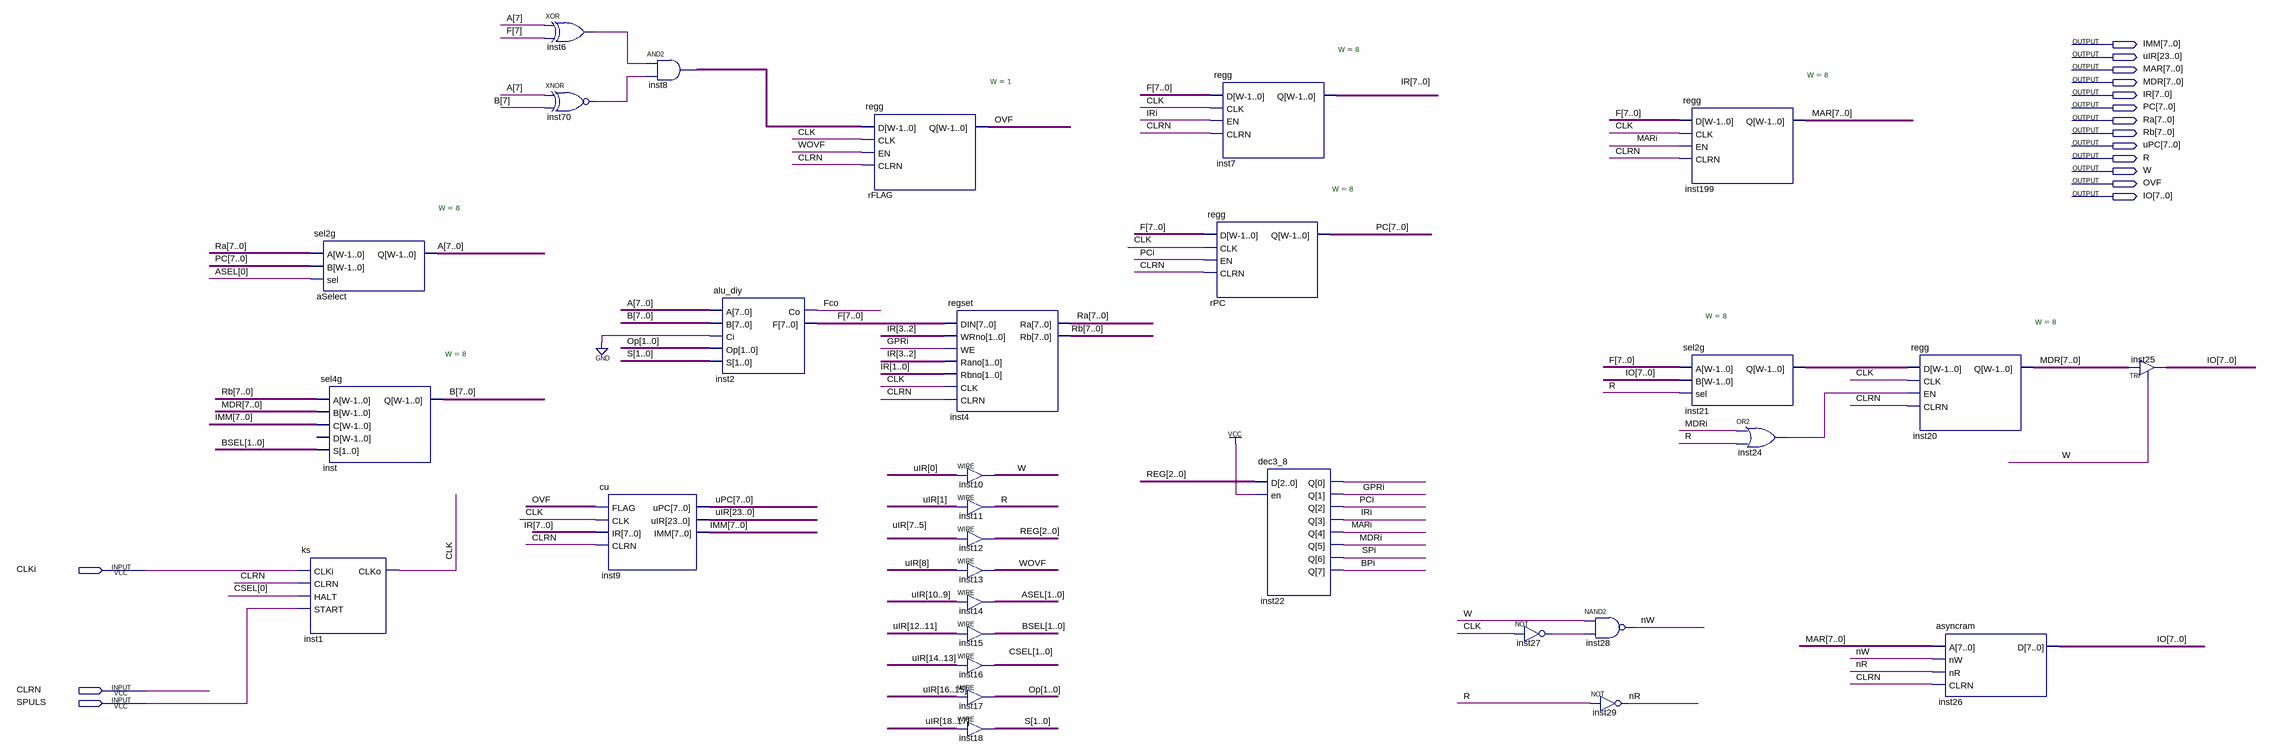
[diagram p0: schematic sheet]
// Quartus schematic model.bdf as structural Verilog: 31 symbols, 16 pins
module model (
  input  CLKi,
  input  CLRN,
  input  SPULS,
  output [7:0] IMM,
  output [23:0] uIR,
  output [7:0] MAR,
  output [7:0] MDR,
  output [7:0] IR,
  output [7:0] PC,
  output [7:0] Ra,
  output [7:0] Rb,
  output [7:0] uPC,
  output R,
  output W,
  output OVF,
  output [7:0] IO
);

  wire BPi, CLK, Fco, GPRi, inst6_out, inst8_out, inst22_q, inst24_out, inst27_out, inst70_out, IRi, MARi,
       MDRi, nR, nW, PCi, SPi, WOVF;
  wire [1:0] ASEL, BSEL, CSEL, Op, S;
  wire [2:0] REG;
  wire [7:0] A, B, F, inst21_q;

  sel2g #(.W(8)) aSelect (.A(Ra), .B(PC), .sel(ASEL[0]), .Q(A));
  sel4g #(.W(8)) inst (.A(Rb), .B(MDR), .C(IMM), .S(BSEL), .Q(B));  // open: D
  ks inst1 (.CLKi(CLKi), .CLRN(CLRN), .HALT(CSEL[0]), .START(SPULS), .CLKo(CLK));
  xor inst6 (inst6_out, A[7], F[7]);
  xnor inst70 (inst70_out, A[7], B[7]);
  cu inst9 (.FLAG(OVF), .CLK(CLK), .IR(IR), .CLRN(CLRN), .uPC(uPC), .uIR(uIR), .IMM(IMM));
  and inst8 (inst8_out, inst6_out, inst70_out);
  alu_diy inst2 (.A(A), .B(B), .Ci(1'b0), .Op(Op), .S(S), .Co(Fco), .F(F));
  regg #(.W(1)) rFLAG (.D(inst8_out), .CLK(CLK), .EN(WOVF), .CLRN(CLRN), .Q(OVF));
  regset inst4 (
    .DIN(F), .WRno(IR[3:2]), .WE(GPRi), .Rano(IR[3:2]), .Rbno(IR[1:0]), .CLK(CLK), .CLRN(CLRN), .Ra(Ra),
    .Rb(Rb));
  assign W = uIR[0];  // WIRE inst10
  assign R = uIR[1];  // WIRE inst11
  assign REG = uIR[7:5];  // WIRE inst12
  assign WOVF = uIR[8];  // WIRE inst13
  assign ASEL = uIR[10:9];  // WIRE inst14
  assign BSEL = uIR[12:11];  // WIRE inst15
  assign CSEL = uIR[14:13];  // WIRE inst16
  assign Op = uIR[16:15];  // WIRE inst17
  assign S = uIR[18:17];  // WIRE inst18
  regg #(.W(8)) rPC (.D(F), .CLK(CLK), .EN(PCi), .CLRN(CLRN), .Q(PC));
  regg #(.W(8)) inst7 (.D(F), .CLK(CLK), .EN(IRi), .CLRN(CLRN), .Q(IR));
  dec3_8 inst22 (.D(REG), .en(1'b1), .Q({BPi, SPi, MDRi, MARi, IRi, PCi, GPRi, inst22_q}));
  not inst27 (inst27_out, CLK);
  nand inst28 (nW, W, inst27_out);
  not inst29 (nR, R);
  regg #(.W(8)) inst199 (.D(F), .CLK(CLK), .EN(MARi), .CLRN(CLRN), .Q(MAR));
  sel2g #(.W(8)) inst21 (.A(F), .B(IO), .sel(R), .Q(inst21_q));
  or inst24 (inst24_out, MDRi, R);
  regg #(.W(8)) inst20 (.D(inst21_q), .CLK(CLK), .EN(inst24_out), .CLRN(CLRN), .Q(MDR));
  asyncram inst26 (.A(MAR), .nW(nW), .nR(nR), .CLRN(CLRN), .D(IO));
  TRI inst25[7:0] (.IN(MDR), .OE(W), .OUT(IO));
endmodule
